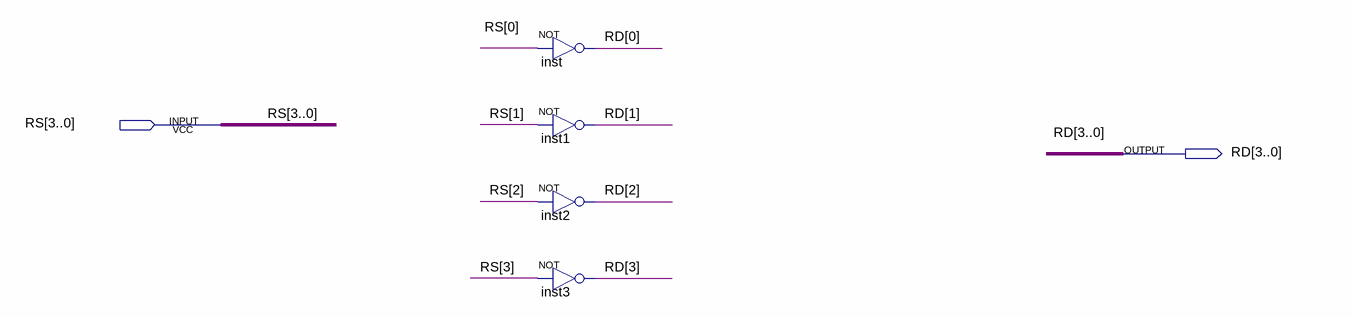
[diagram p0: schematic sheet]
// Quartus schematic Group03_2023510056_ALU_NOT.bdf as structural Verilog: 4 symbols, 2 pins
module Group03_2023510056_ALU_NOT (
  input  [3:0] RS,
  output [3:0] RD
);

  not inst (RD[0], RS[0]);
  not inst1 (RD[1], RS[1]);
  not inst2 (RD[2], RS[2]);
  not inst3 (RD[3], RS[3]);
endmodule
